# Altium schematic sheet schematicPCB.SchDoc
size A; SheetNumber: 2; SheetTotal: 3
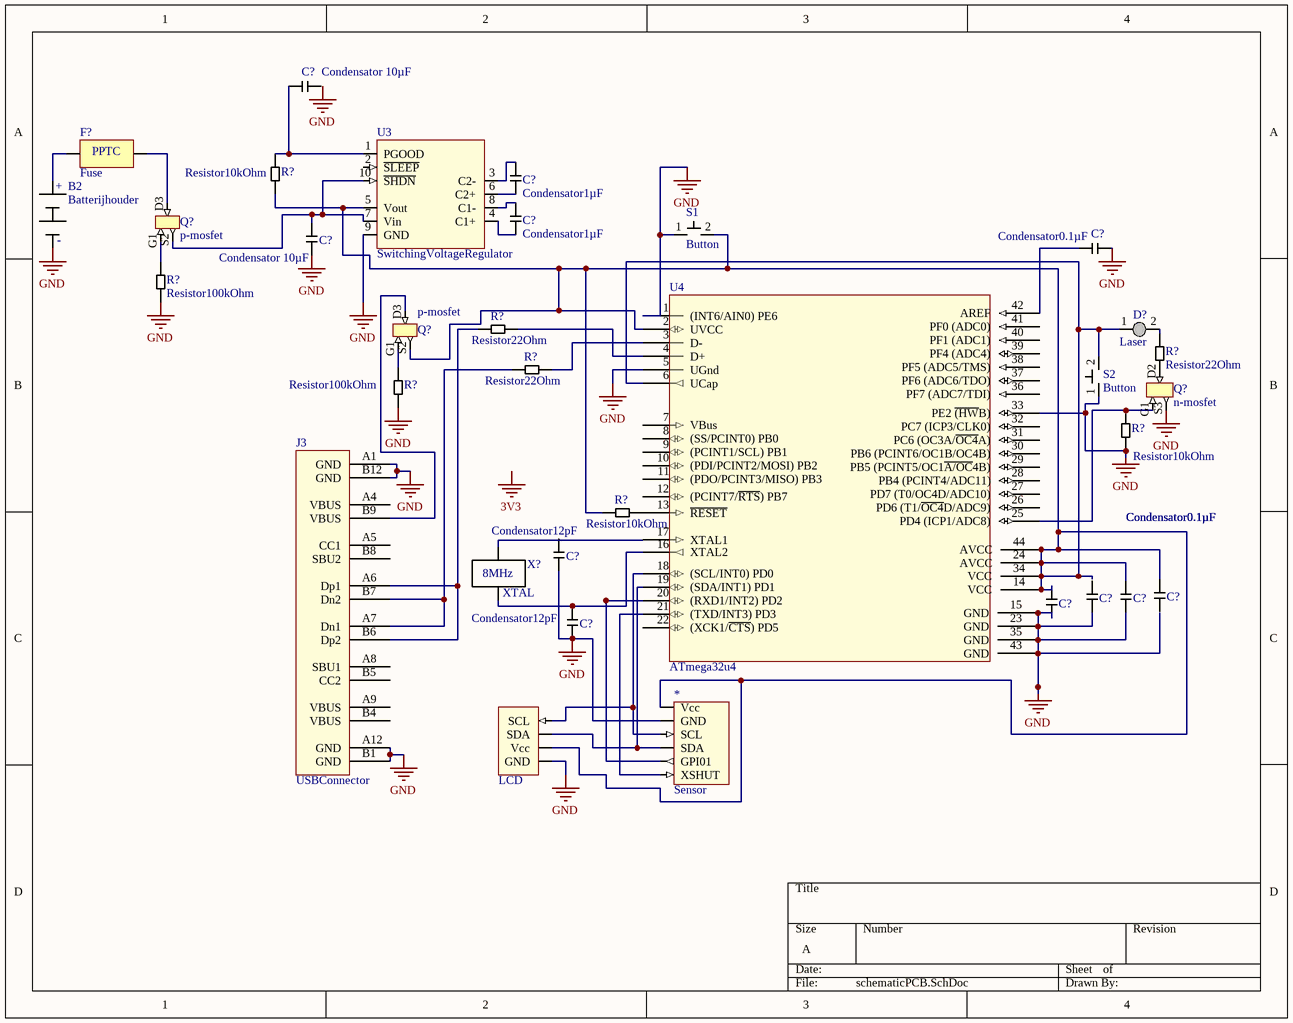
[diagram p0: schematicPCB.SchDoc]

## Parts
(Parts that share a designator on the sheet are numbered #1, #2 ... from top to bottom, then left to right.)
*#1  Sensor
*#2  LCD
B2  Batterijhouder
C?#1  Condensator 10µF  [CAPC0603X035M]
C?#2  Condensator1µF  [CAPC1812X18M]
C?#3  Condensator1µF  [CAPC1812X18M]
C?#4  Condensator0.1µF  [CAPC1210X70M]
C?#5  Condensator 10µF  [CAPC0603X035M]
C?#6  Condensator12pF  [CAPC1210X14M]
C?#7  Condensator0.1µF  [CAPC1210X70M]
C?#8  Condensator0.1µF  [CAPC1210X70M]
C?#9  Condensator0.1µF  [CAPC1210X70M]
C?#10  Condensator0.1µF  [CAPC1210X70M]
C?#11  Condensator12pF  [CAPC1210X14M]
D?  Laser
F?  Fuse  [RESC4632X15M]
J3  USBConnector
Q?#1  p-mosfet
Q?#2  p-mosfet
Q?#3  n-mosfet
R?#1  Resistor10kOhm  [R1210X06M]
R?#2  Resistor100kOhm
R?#3  Resistor22Ohm  [R0805X045M]
R?#4  Resistor22Ohm  [R0805X045M]
R?#5  Resistor22Ohm  [R0805X045M]
R?#6  Resistor100kOhm
R?#7  Resistor10kOhm  [R1210X06M]
R?#8  Resistor10kOhm  [R1210X06M]
S1  Button
S2  Button
U3  SwitchingVoltageRegulator  [SON50P300X100_HS-11M]
U4  ATmega32u4  [TQFP80P1200X1200X100_HS-45N]
X?  XTAL  [CAPC13550X20N]

## Nets
GND: *#1.2(GND) *#2.4(GND) B2.2 C?#4.2 C?#5.1 C?#6.1 C?#7.1 C?#8.1 C?#10.1 C?#11.1 J3.A1(GND) J3.A12(GND) J3.B1(GND) J3.B12(GND) Q?#3.S3(Source) R?#2.2 R?#6.1 R?#7.1 S1.1 S2.1 U3.9(GND) U4.1((INT6/AIN0)_PE6) U4.5(UGnd) U4.15(GND) U4.23(GND) U4.33(PE2_~{(HW}B)) U4.35(GND) U4.43(GND)
Net*#1_1: *#1.1(Vcc) *#2.5(Vcc) C?#8.2 C?#9.2 C?#10.2 D?.1(+) Q?#2.S2(Source) R?#1.2 R?#8.1 S1.2 S2.2 U3.5(Vout) U4.2(UVCC) U4.6(UCap) U4.14(VCC) U4.24(AVCC) U4.34(VCC) U4.44(AVCC)
Net*#1_3: *#1.3(SCL) *#2.7(SCL) U4.18((SCL/INT0)_PD0)
Net*#1_4: *#1.4(SDA) *#2.6(SDA) U4.19((SDA/INT1)_PD1)
Net*#1_5: *#1.5(GPI01) U4.20((RXD1/INT2)_PD2)
Net*#1_6: *#1.6(XSHUT) U4.21((TXD/INT3)_PD3)
NetB2_1: B2.1 F?.1
NetC?#1_1: C?#1.1 R?#1.1 U3.1(PGOOD)
NetC?#2_1: C?#2.1 U3.6(C2+)
NetC?#2_2: C?#2.2 U3.3(C2-)
NetC?#3_1: C?#3.1 U3.4(C1+)
NetC?#3_2: C?#3.2 U3.8(C1-)
NetC?#4_1: C?#4.1 U4.42(AREF)
NetC?#5_2: C?#5.2 Q?#1.S2(Source) U3.7(Vin) U3.10(~{SHDN})
NetC?#11_2: C?#11.2 U4.16(XTAL2) X?.2(Xtal__2)
NetD?_2: D?.2(-) R?#5.2
NetF?_2: F?.2 Q?#1.D3
NetJ3_A6: J3.A6(Dp1) J3.B6(Dp2) R?#3.1
NetJ3_A7: J3.A7(Dn1) J3.B7(Dn2) R?#4.1
NetJ3_B9: J3.B9(VBUS) Q?#2.D3
NetQ?#1_G1: Q?#1.G1(Gate) R?#2.1
NetQ?#2_G1: Q?#2.G1(Gate) R?#6.2
NetQ?#3_G1: Q?#3.G1(Gate) R?#7.2 U4.25(PD4_(ICP1/ADC8))
NetR?#3_2: R?#3.2 U4.4(D+)
NetR?#4_2: R?#4.2 U4.3(D-)
NetR?#8_2: R?#8.2 U4.13(~{RESET})
NetU4_17: U4.17(XTAL1) X?.1(Xtal_1)

Not connected (* = marked no-connect by the designer): C?#1 2; C?#6 2; C?#7 2; C?#9 1; J3 A4(VBUS) A5(CC1) A8(SBU1) A9(VBUS) B4(VBUS) B5(CC2) B8(SBU2); Q?#3 D2(D); R?#5 1; U3 2(~{SLEEP}); U4 7(VBus) 8((SS/PCINT0)_PB0) 9((PCINT1/SCL)_PB1) 10((PDI/PCINT2/MOSI)_PB2) 11((PDO/PCINT3/MISO)_PB3) 12((PCINT7/~{RTS})_PB7) 22((XCK1/~{CTS})_PD5) 26(PD6_(T1/~{OC4}D/ADC9)) 27(PD7_(T0/OC4D/ADC10)) 28(PB4_(PCINT4/ADC11)) 29(PB5_(PCINT5/OC1~{A/OC}4B)) 30(PB6_(PCINT6/OC1B/OC4B)) 31(PC6_(OC3A/~{OC4}A)) 32(PC7_(ICP3/CLK0)) 36(PF7_(ADC7/TDI)) 37(PF6_(ADC6/TDO)) 38(PF5_(ADC5/TMS)) 39(PF4_(ADC4)) 40(PF1_(ADC1)) 41(PF0_(ADC0))

## Notes on the sheet
- Labels drawn without touching a wire or pin: 3V3, GND
- (in symbol Batterijhouder) +; -
- (in symbol Fuse) PPTC
- (in symbol XTAL) 8MHz